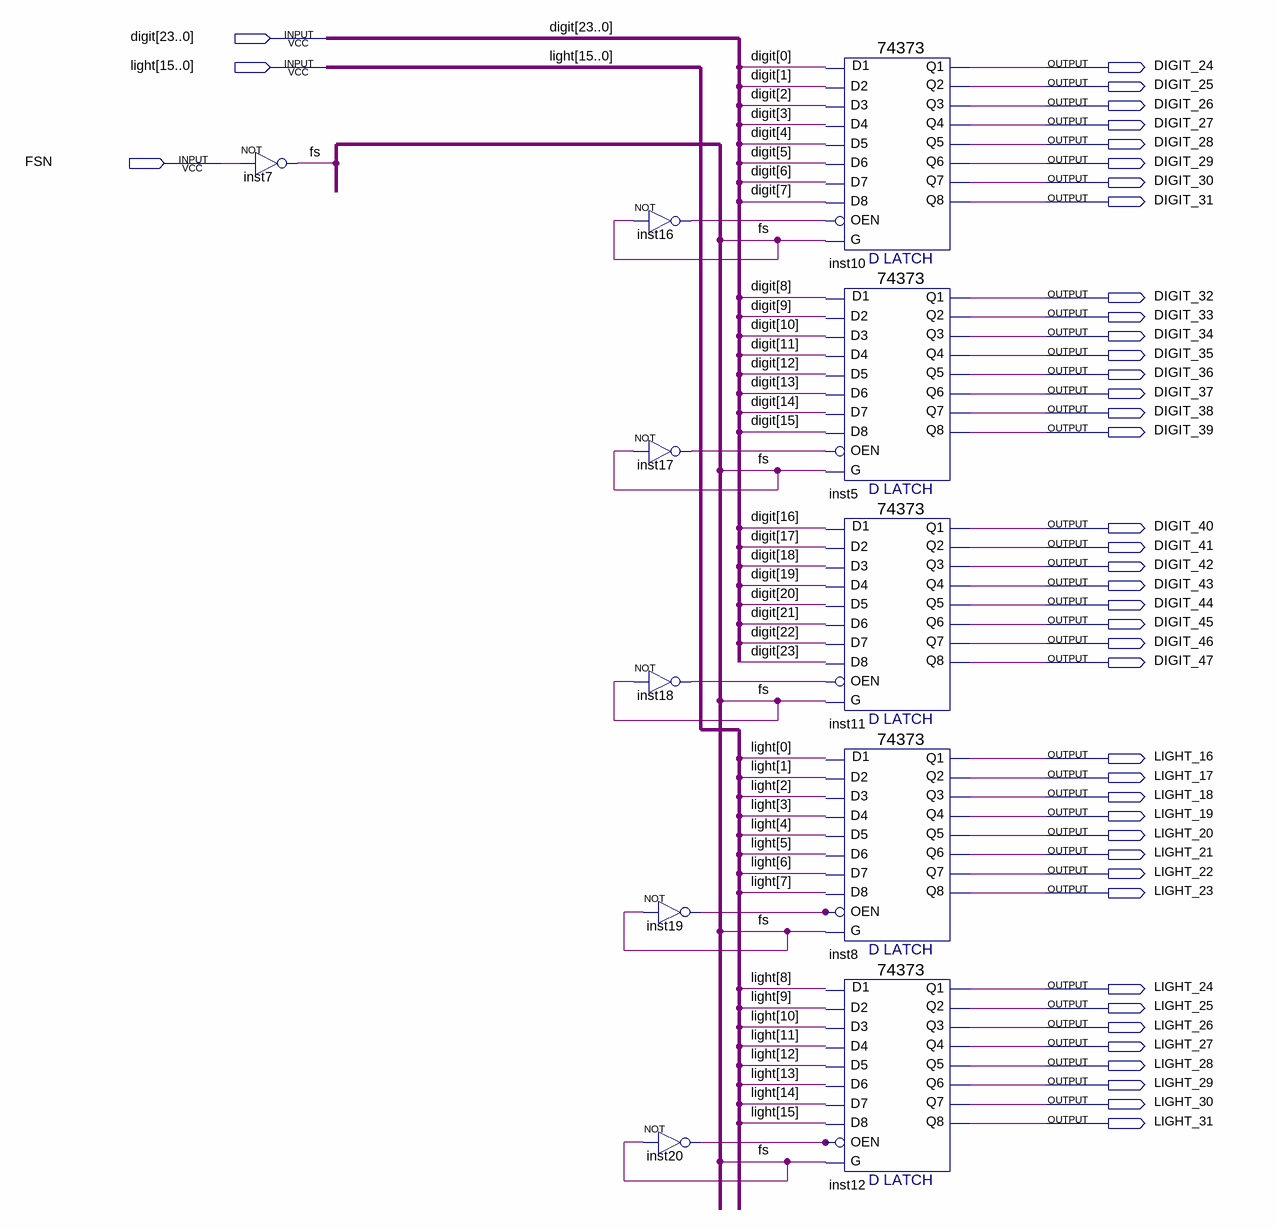
[diagram p0: schematic sheet]
// Quartus schematic FRAME_LATCH.bdf as structural Verilog: 11 symbols, 43 pins
module FRAME_LATCH (
  input  [23:0] digit,
  input  [15:0] light,
  input  FSN,
  output DIGIT_24,
  output DIGIT_25,
  output DIGIT_26,
  output DIGIT_27,
  output DIGIT_28,
  output DIGIT_29,
  output DIGIT_30,
  output DIGIT_31,
  output DIGIT_32,
  output DIGIT_33,
  output DIGIT_34,
  output DIGIT_35,
  output DIGIT_36,
  output DIGIT_37,
  output DIGIT_38,
  output DIGIT_39,
  output DIGIT_40,
  output DIGIT_41,
  output DIGIT_42,
  output DIGIT_43,
  output DIGIT_44,
  output DIGIT_45,
  output DIGIT_46,
  output DIGIT_47,
  output LIGHT_16,
  output LIGHT_17,
  output LIGHT_18,
  output LIGHT_19,
  output LIGHT_20,
  output LIGHT_21,
  output LIGHT_22,
  output LIGHT_23,
  output LIGHT_24,
  output LIGHT_25,
  output LIGHT_26,
  output LIGHT_27,
  output LIGHT_28,
  output LIGHT_29,
  output LIGHT_30,
  output LIGHT_31
);

  wire fs, inst16_out, inst17_out, inst18_out, inst19_out, inst20_out;

  not inst7 (fs, FSN);
  not inst16 (inst16_out, fs);
  not inst17 (inst17_out, fs);
  not inst18 (inst18_out, fs);
  not inst19 (inst19_out, fs);
  not inst20 (inst20_out, fs);
  \74373  inst10 (
    .D1(digit[0]), .D3(digit[2]), .D6(digit[5]), .D7(digit[6]), .D2(digit[1]), .G(fs), .D4(digit[3]),
    .D5(digit[4]), .D8(digit[7]), .OEN(inst16_out), .Q3(DIGIT_26), .Q6(DIGIT_29), .Q7(DIGIT_30),
    .Q2(DIGIT_25), .Q8(DIGIT_31), .Q4(DIGIT_27), .Q5(DIGIT_28), .Q1(DIGIT_24));
  \74373  inst5 (
    .D1(digit[8]), .D3(digit[10]), .D6(digit[13]), .D7(digit[14]), .D2(digit[9]), .G(fs), .D4(digit[11]),
    .D5(digit[12]), .D8(digit[15]), .OEN(inst17_out), .Q3(DIGIT_34), .Q6(DIGIT_37), .Q7(DIGIT_38),
    .Q2(DIGIT_33), .Q8(DIGIT_39), .Q4(DIGIT_35), .Q5(DIGIT_36), .Q1(DIGIT_32));
  \74373  inst11 (
    .D1(digit[16]), .D3(digit[18]), .D6(digit[21]), .D7(digit[22]), .D2(digit[17]), .G(fs), .D4(digit[19]),
    .D5(digit[20]), .D8(digit[23]), .OEN(inst18_out), .Q3(DIGIT_42), .Q6(DIGIT_45), .Q7(DIGIT_46),
    .Q2(DIGIT_41), .Q8(DIGIT_47), .Q4(DIGIT_43), .Q5(DIGIT_44), .Q1(DIGIT_40));
  \74373  inst8 (
    .D1(light[0]), .D3(light[2]), .D6(light[5]), .D7(light[6]), .D2(light[1]), .G(fs), .D4(light[3]),
    .D5(light[4]), .D8(light[7]), .OEN(inst19_out), .Q3(LIGHT_18), .Q6(LIGHT_21), .Q7(LIGHT_22),
    .Q2(LIGHT_17), .Q8(LIGHT_23), .Q4(LIGHT_19), .Q5(LIGHT_20), .Q1(LIGHT_16));
  \74373  inst12 (
    .D1(light[8]), .D3(light[10]), .D6(light[13]), .D7(light[14]), .D2(light[9]), .G(fs), .D4(light[11]),
    .D5(light[12]), .D8(light[15]), .OEN(inst20_out), .Q3(LIGHT_26), .Q6(LIGHT_29), .Q7(LIGHT_30),
    .Q2(LIGHT_25), .Q8(LIGHT_31), .Q4(LIGHT_27), .Q5(LIGHT_28), .Q1(LIGHT_24));
endmodule
